# EAGLE design switch-smd-16mm-mk-1.0 (EAGLE 7.5.0)
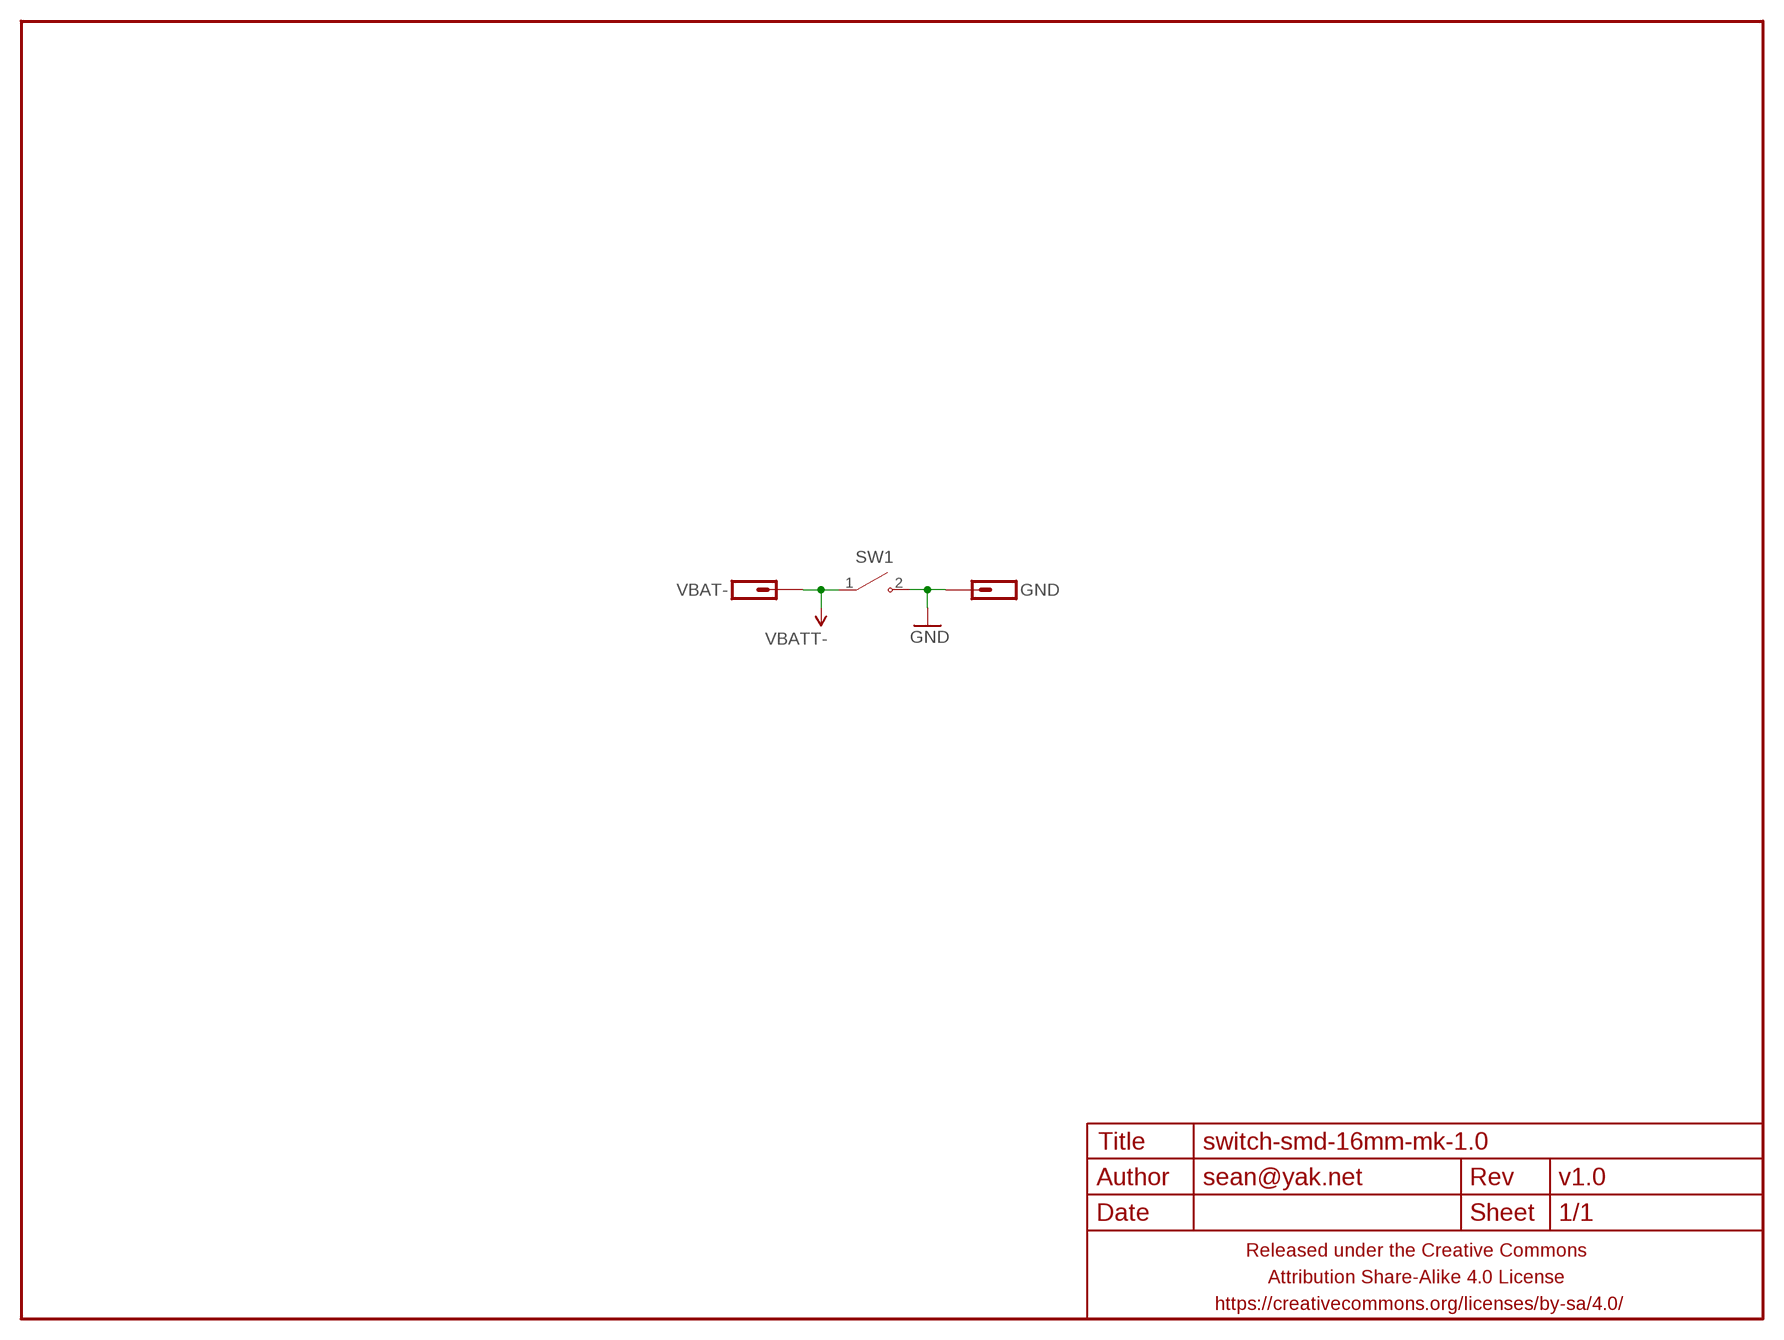
[diagram p0: schematic, sheet 1]

## Parts
FRAME1  FRAME-LETTERNO_PACKAGE  [DUMMY]
GND  M01NOT-A-VIA-NOPE  [1X01_NOSILK_NOSTOP]
SW1  SWITCH-SPSTOMTEN-1288-LESS2  [OMTEN-1288-LESS2]
VBAT-  M01PTH-1.2MM-NS  [1X01-1.2MM-NS]

## Nets
GND: GND.P$1 SW1.2(NO)
VBAT: SW1.1(COM) VBAT-.P$1 ; supply symbol labelled VBATT-

## Library data of the parts
FRAME1 = a_parts:FRAME-LETTER: Schematic Frame Standard 8.5x11 US Letter frame; DESIGNER: sean@yak.net; VERSION: v1.0
GND VBAT- = a_parts:M01: Header 1 Standard 1-pin 0.1" header. Use with straight break away headers (SKU : PRT-00116), right angle break away headers (PRT-00553), swiss pins (PRT-00743), machine pins (PRT-00117), and female headers (PRT-00115).
SW1 = a_parts:SWITCH-SPST

## Board
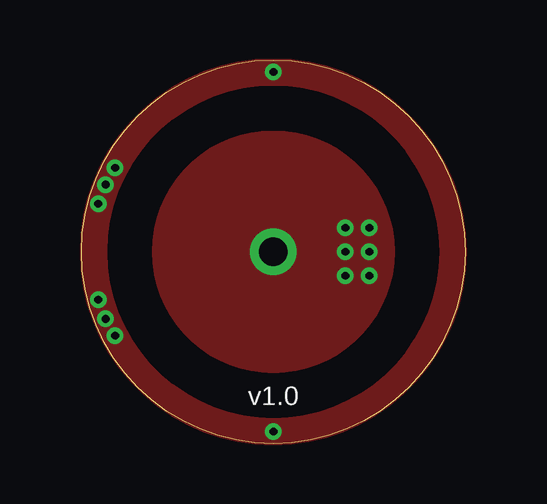
[diagram p1: board, top side]
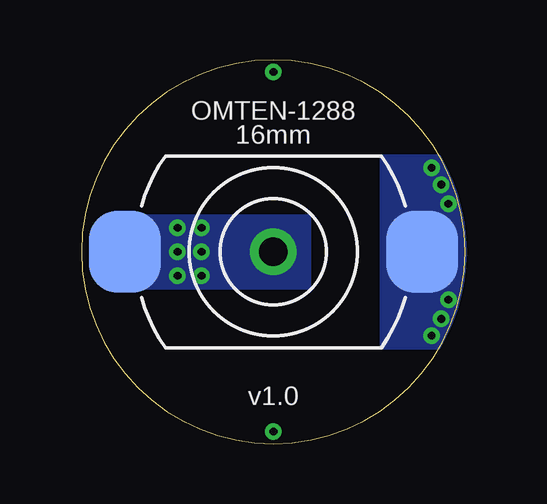
[diagram p2: board, bottom side, seen from below]

Size 16 x 16 mm. Coordinates in mm from the lower left corner, seen from the top.
Outline: 0,8 arc-180 16,8 arc-180 0,8
Copper layers (1*16): Top 0.0356mm / dielectric 1.5011mm / Bottom 0.0356mm
Design rules "LaenPCBOrder2 *": minimum track width 6mil, minimum drill 13mil, track to track 6mil, track to pad 6mil, pad to pad 6mil, via to via 6mil, smd to smd 6mil, copper to edge 0mil, drill to drill 6mil, minimum pad ring 7mil, minimum via ring 7mil, stop-mask expansion 3mil, vias tented up to drill 20mil, thermal gap 10mil

### Footprints (pad centres in the part's own frame; a part is rotated, then mirrored left to right if it is on the bottom)
1X01_NOSILK_NOSTOP = drill 0.33: P$1 0,0
OMTEN-1288-LESS2 = smd 3 x 3.4: 1 -6.2,0; 2 6.2,0
1X01-1.2MM-NS = drill 1.2 pad 1.93: P$1 0,0

### Placement (x,y rotation side)
FRAME1  0,0 0 top
GND  8,15.5 90 bottom
SW1  8,8 0 bottom
VBAT-  8,8 0 top

### Tracks (layer width: path | path; a pad name or v marks a point on that pad's centre or on a via)
GND  (via drill 0.33)
  other vias: 8,0.5 0.7,6 0.7,10 1,5.2 1.4,4.5 1,10.8 1.4,11.5
  pour Top (isolate 0.152, rank 6, no thermals): 16,8 arc90 8,16 arc90 0,8 1,8 arc-90 8,15 arc-90 15,8
  pour Top (isolate 0.152, rank 6, no thermals): 0,8 arc90 8,0 arc90 16,8 15,8 arc-90 8,1 arc-90 1,8
  pour Bottom (isolate 0.152, no thermals): 0,8 arc30 1.1,4 3.5,4 3.5,12 1.1,12 arc30
VBAT  (via drill 0.33)
  other vias: 11,8 11,9 11,7 12,8 12,9 12,7
  pour Bottom (isolate 0.152, no thermals): 15,9.5 6.5,9.5 6.5,6.5 15,6.5
  pour Top (isolate 0.152, no thermals): 3,8 arc90 8,3 arc90 13,8 arc90 8,13 arc90

### Text on the board
bPlace: OMTEN-1288 | 16mm